# Altium schematic sheet Top.SchDoc
size A4; Organization: Altium Limited; Address1: L3, 12a Rodborough Rd; Address2: Frenchs Forest; Address3: NSW; Address4: Australia 2086
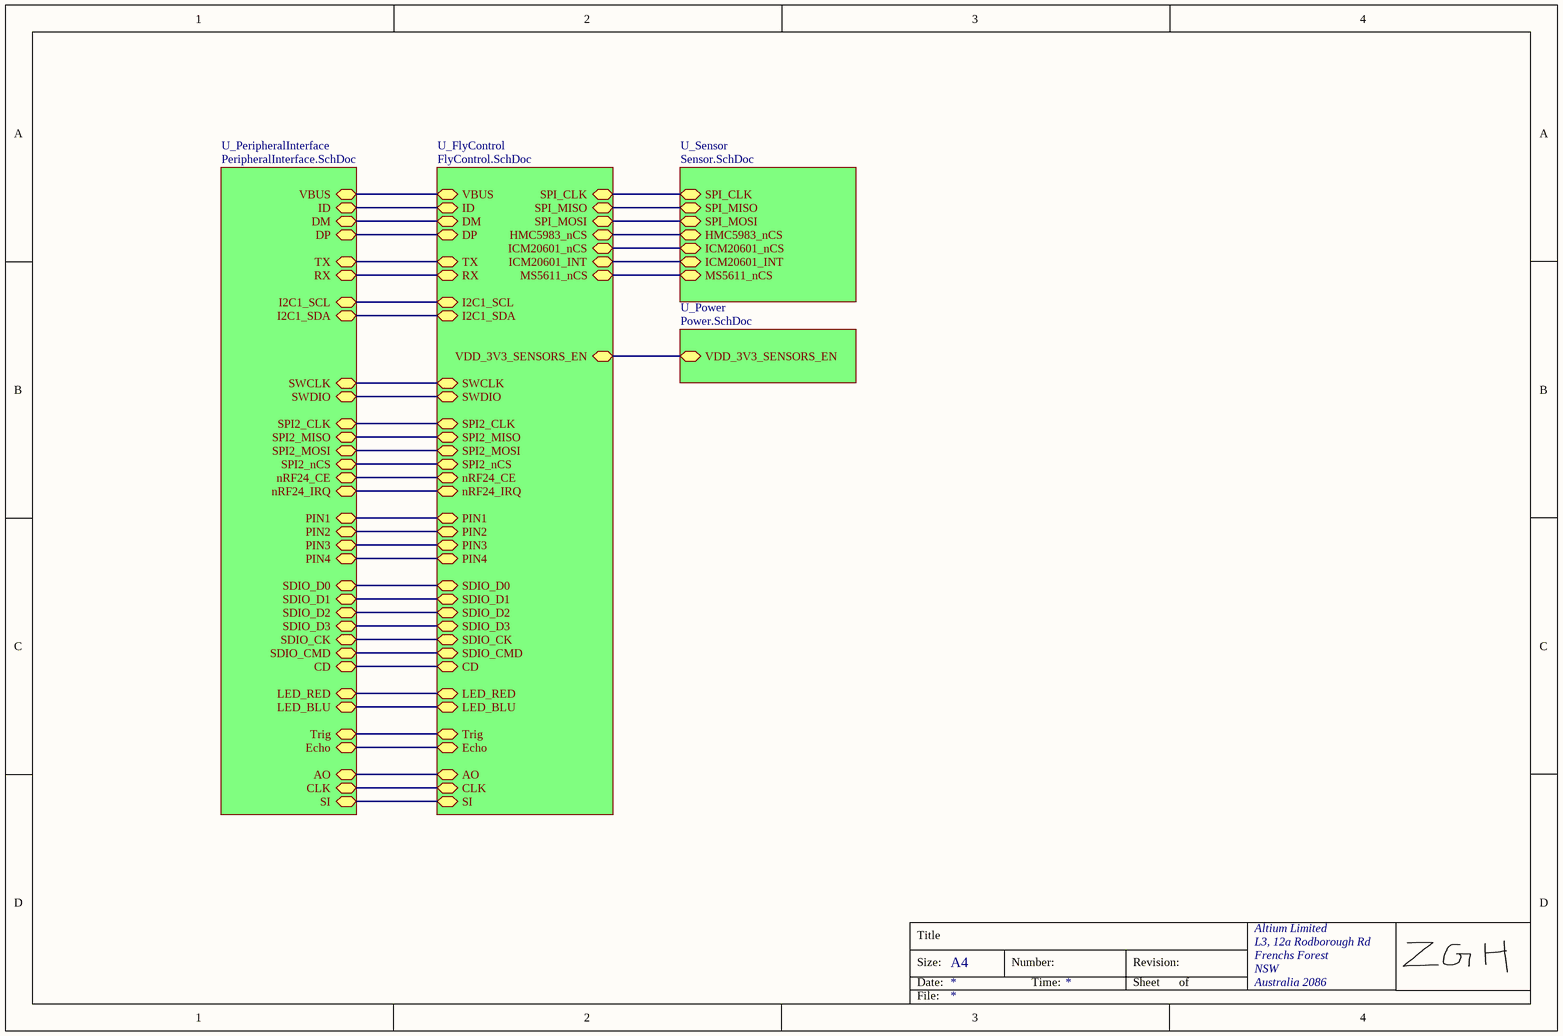
[diagram p0: Top.SchDoc]

## Sub-sheets
U_FlyControl = FlyControl.SchDoc: ICM20601_nCS, HMC5983_nCS, SPI_MOSI, SPI_MISO, SPI_CLK, VDD_3V3_SENSORS_EN, VBUS, ID, DM, DP, TX, RX, I2C1_SCL, I2C1_SDA, SWCLK, SWDIO, SPI2_CLK, SPI2_MISO, SPI2_MOSI, SPI2_nCS, PIN1, PIN2, PIN3, PIN4, SDIO_D2, SDIO_D3, SDIO_D0, SDIO_D1, SDIO_CK, SDIO_CMD, CD, LED_BLU, LED_RED, nRF24_CE, nRF24_IRQ, Trig, Echo, AO, CLK, SI, ICM20601_INT, MS5611_nCS
U_PeripheralInterface = PeripheralInterface.SchDoc: VBUS, ID, DM, DP, TX, RX, I2C1_SCL, I2C1_SDA, SWCLK, SWDIO, SPI2_CLK, SPI2_MISO, SPI2_MOSI, SPI2_nCS, PIN1, PIN2, PIN3, PIN4, SDIO_D2, SDIO_D3, SDIO_D0, SDIO_D1, SDIO_CK, SDIO_CMD, CD, LED_BLU, LED_RED, nRF24_CE, nRF24_IRQ, Trig, Echo, AO, CLK, SI
U_Power = Power.SchDoc: VDD_3V3_SENSORS_EN
U_Sensor = Sensor.SchDoc: SPI_CLK, SPI_MISO, SPI_MOSI, HMC5983_nCS, ICM20601_nCS, ICM20601_INT, MS5611_nCS

## Nets
(unnamed): sheet U_FlyControl/ICM20601_nCS, sheet U_Sensor/ICM20601_nCS
(unnamed): sheet U_FlyControl/HMC5983_nCS, sheet U_Sensor/HMC5983_nCS
(unnamed): sheet U_FlyControl/SPI_MOSI, sheet U_Sensor/SPI_MOSI
(unnamed): sheet U_FlyControl/SPI_MISO, sheet U_Sensor/SPI_MISO
(unnamed): sheet U_FlyControl/SPI_CLK, sheet U_Sensor/SPI_CLK
(unnamed): sheet U_FlyControl/VDD_3V3_SENSORS_EN, sheet U_Power/VDD_3V3_SENSORS_EN
(unnamed): sheet U_FlyControl/VBUS, sheet U_PeripheralInterface/VBUS
(unnamed): sheet U_FlyControl/ID, sheet U_PeripheralInterface/ID
(unnamed): sheet U_FlyControl/DM, sheet U_PeripheralInterface/DM
(unnamed): sheet U_FlyControl/DP, sheet U_PeripheralInterface/DP
(unnamed): sheet U_FlyControl/TX, sheet U_PeripheralInterface/TX
(unnamed): sheet U_FlyControl/RX, sheet U_PeripheralInterface/RX
(unnamed): sheet U_FlyControl/I2C1_SCL, sheet U_PeripheralInterface/I2C1_SCL
(unnamed): sheet U_FlyControl/I2C1_SDA, sheet U_PeripheralInterface/I2C1_SDA
(unnamed): sheet U_FlyControl/SWCLK, sheet U_PeripheralInterface/SWCLK
(unnamed): sheet U_FlyControl/SWDIO, sheet U_PeripheralInterface/SWDIO
(unnamed): sheet U_FlyControl/SPI2_CLK, sheet U_PeripheralInterface/SPI2_CLK
(unnamed): sheet U_FlyControl/SPI2_MISO, sheet U_PeripheralInterface/SPI2_MISO
(unnamed): sheet U_FlyControl/SPI2_MOSI, sheet U_PeripheralInterface/SPI2_MOSI
(unnamed): sheet U_FlyControl/SPI2_nCS, sheet U_PeripheralInterface/SPI2_nCS
(unnamed): sheet U_FlyControl/PIN1, sheet U_PeripheralInterface/PIN1
(unnamed): sheet U_FlyControl/PIN2, sheet U_PeripheralInterface/PIN2
(unnamed): sheet U_FlyControl/PIN3, sheet U_PeripheralInterface/PIN3
(unnamed): sheet U_FlyControl/PIN4, sheet U_PeripheralInterface/PIN4
(unnamed): sheet U_FlyControl/SDIO_D2, sheet U_PeripheralInterface/SDIO_D2
(unnamed): sheet U_FlyControl/SDIO_D3, sheet U_PeripheralInterface/SDIO_D3
(unnamed): sheet U_FlyControl/SDIO_D0, sheet U_PeripheralInterface/SDIO_D0
(unnamed): sheet U_FlyControl/SDIO_D1, sheet U_PeripheralInterface/SDIO_D1
(unnamed): sheet U_FlyControl/SDIO_CK, sheet U_PeripheralInterface/SDIO_CK
(unnamed): sheet U_FlyControl/SDIO_CMD, sheet U_PeripheralInterface/SDIO_CMD
(unnamed): sheet U_FlyControl/CD, sheet U_PeripheralInterface/CD
(unnamed): sheet U_FlyControl/LED_BLU, sheet U_PeripheralInterface/LED_BLU
(unnamed): sheet U_FlyControl/LED_RED, sheet U_PeripheralInterface/LED_RED
(unnamed): sheet U_FlyControl/nRF24_CE, sheet U_PeripheralInterface/nRF24_CE
(unnamed): sheet U_FlyControl/nRF24_IRQ, sheet U_PeripheralInterface/nRF24_IRQ
(unnamed): sheet U_FlyControl/Trig, sheet U_PeripheralInterface/Trig
(unnamed): sheet U_FlyControl/Echo, sheet U_PeripheralInterface/Echo
(unnamed): sheet U_FlyControl/AO, sheet U_PeripheralInterface/AO
(unnamed): sheet U_FlyControl/CLK, sheet U_PeripheralInterface/CLK
(unnamed): sheet U_FlyControl/SI, sheet U_PeripheralInterface/SI
(unnamed): sheet U_FlyControl/ICM20601_INT, sheet U_Sensor/ICM20601_INT
(unnamed): sheet U_FlyControl/MS5611_nCS, sheet U_Sensor/MS5611_nCS

## Notes on the sheet
- Title
- Size:
- Date:
- A4
- Number:
- Time:
- Revision:
- Sheet
- of
- File: